# Altium schematic sheet FD-JUL-BB_SCH.SchDoc
size B; DocumentNumber: 1; SheetNumber: 1; SheetTotal: 1; ENG_APP_DATE: --/--/--; DSN_APP_DATE: --/--/--; CHK_APP_DATE: --/--/--
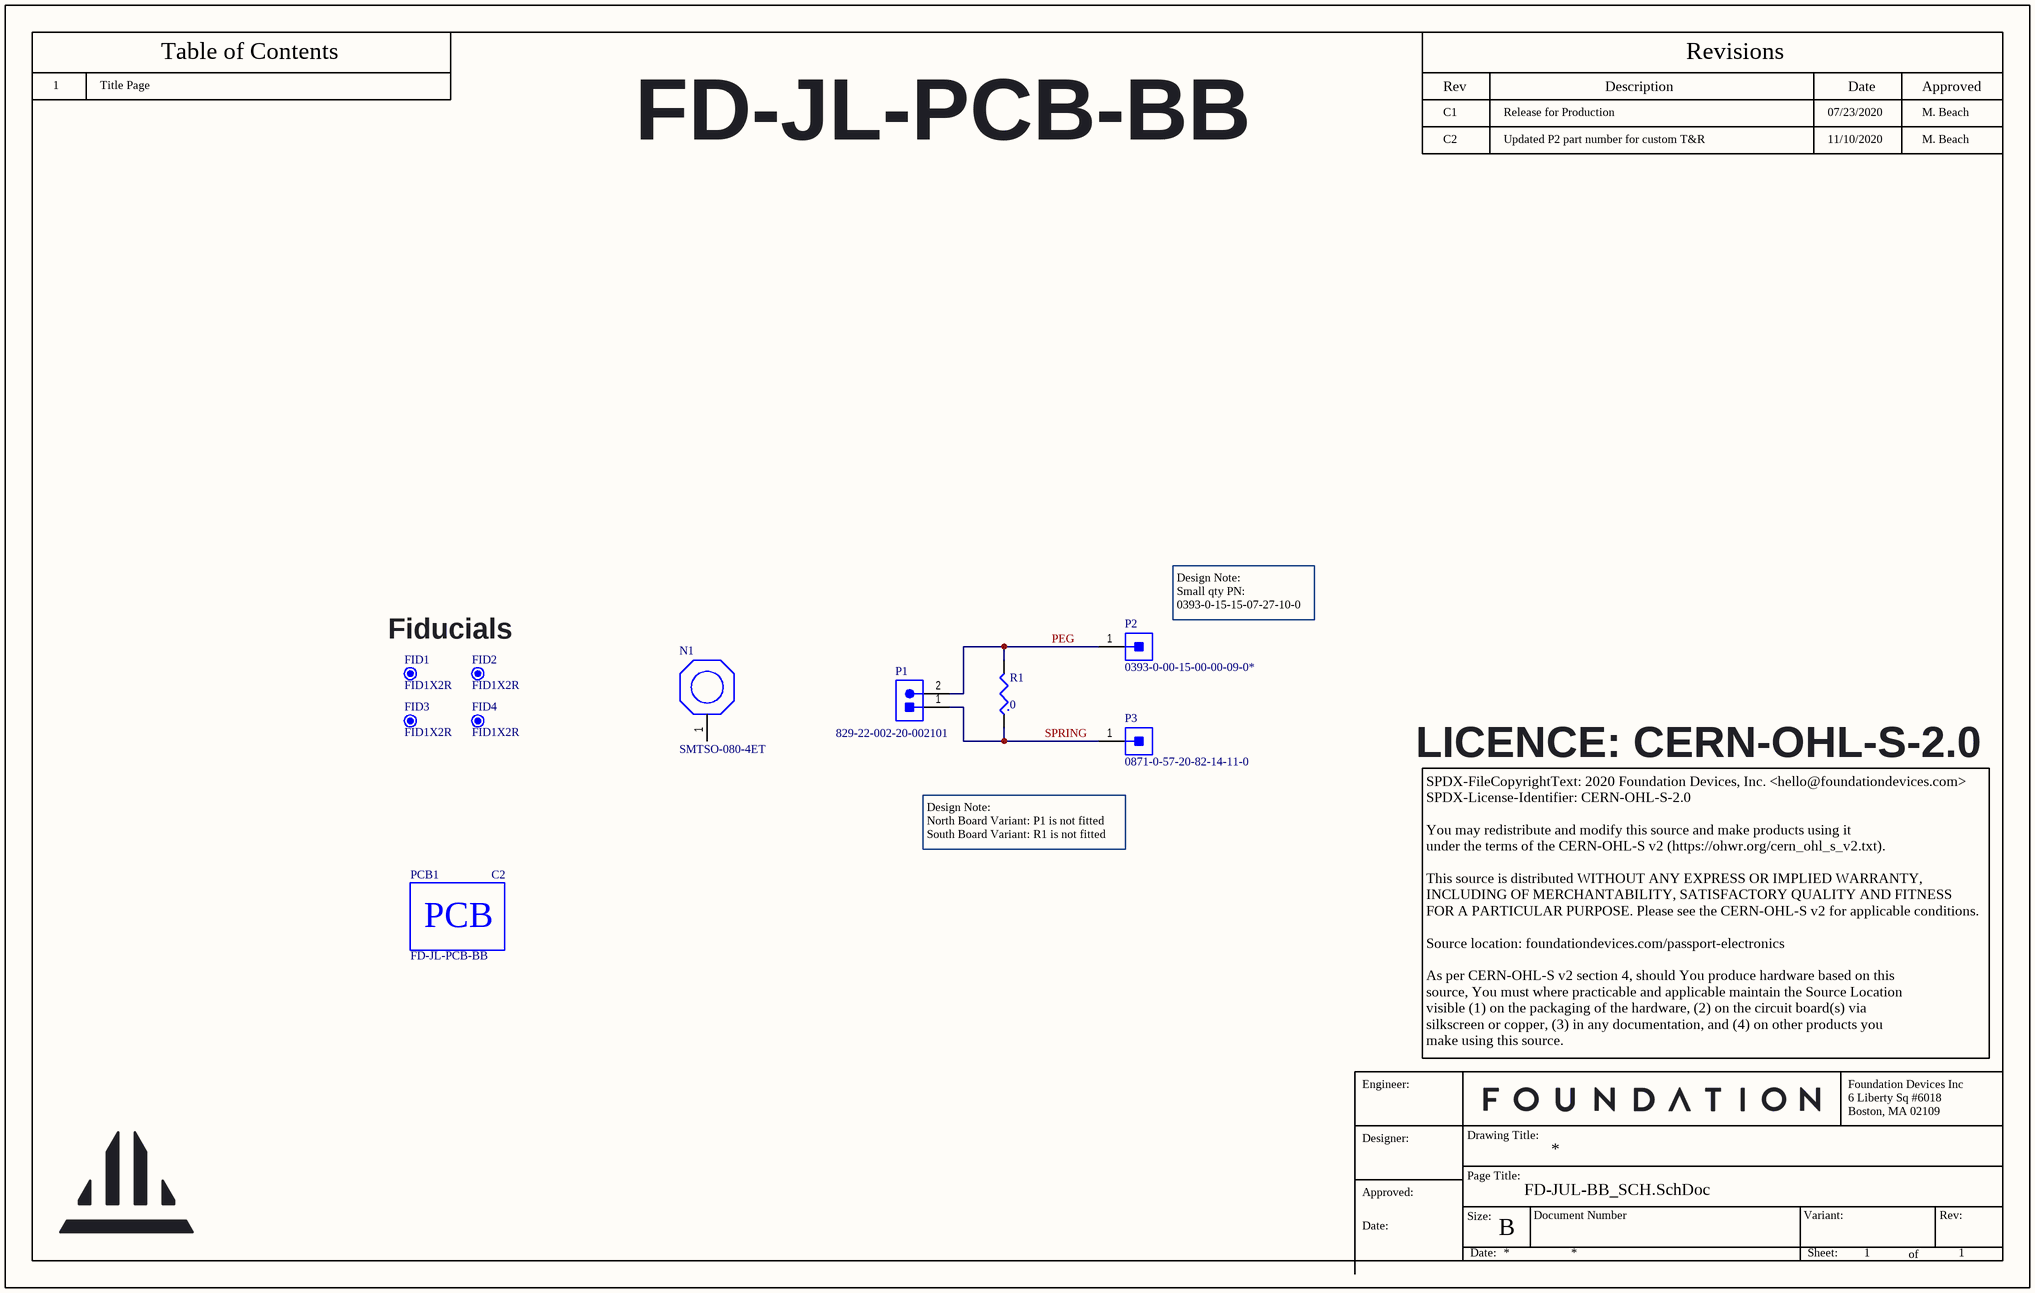
[diagram p0: FD-JUL-BB_SCH.SchDoc]

## Parts
FID1  FID1X2R  [FID1X2R]  (no BOM)
FID2  FID1X2R  [FID1X2R]  (no BOM)
FID3  FID1X2R  [FID1X2R]  (no BOM)
FID4  FID1X2R  [FID1X2R]  (no BOM)
N1  SMTSO-080-4ET  [PNENG - SMTSO-080-4ET]
P1  829-22-002-20-002101  [MIMX - 829-22-002-20-002101_V]
P2  0393-0-00-15-00-00-09-0*  [MIMX - 0393]
P3  0871-0-57-20-82-14-11-0  [MIMX - 0871-0-15-20-82-14-11-0_V]
PCB1  FD-JL-PCB-BB  Rev: C2  (mechanical)
R1  Resistance: 0  [RESC0805(2012)_L]  (hidden comment: RES 0 OHM JUMPER 1/8W 0805)

## Nets
PEG: P1.2 P2.1 R1.2
SPRING: P1.1 P3.1 R1.1

Not connected (* = marked no-connect by the designer): N1 1(Nut)

## Notes on the sheet
- Title Page
- FD-JL-PCB-BB
- C1
- C2
- Release for Production
- Updated P2 part number for custom T&R
- 07/23/2020
- 11/10/2020
- M. Beach
- Fiducials
- Design Note:
  Small qty PN: 0393-0-15-15-07-27-10-0
- LICENCE: CERN-OHL-S-2.0
- Design Note:
  North Board Variant: P1 is not fitted
  South Board Variant: R1 is not fitted
- SPDX-FileCopyrightText: 2020 Foundation Devices, Inc. <hello@foundationdevices.com>
  SPDX-License-Identifier: CERN-OHL-S-2.0
  You may redistribute and modify this source and make products using it
  under the terms of the CERN-OHL-S v2 (https://ohwr.org/cern_ohl_s_v2.txt).
  This source is distributed WITHOUT ANY EXPRESS OR IMPLIED WARRANTY,
  INCLUDING OF MERCHANTABILITY, SATISFACTORY QUALITY AND FITNESS
  FOR A PARTICULAR PURPOSE. Please see the CERN-OHL-S v2 for applicable conditions.
  Source location: foundationdevices.com/passport-electronics
  As per CERN-OHL-S v2 section 4, should You produce hardware based on this
  source, You must where practicable and applicable maintain the Source Location
  visible (1) on the packaging of the hardware, (2) on the circuit board(s) via
  silkscreen or copper, (3) in any documentation, and (4) on other products you
  make using this source.
- 1
- Table of Contents
- Rev
- Description
- Revisions
- Date
- Approved
- Engineer:
- Foundation Devices Inc
- 6 Liberty Sq #6018
- Designer:
- Drawing Title:
- Page Title:
- Boston, MA 02109
- Approved:
- Date:
- Size:
- B
- Document Number
- Variant:
- Rev:
- Sheet:
- of

## Library data of the parts
FID1-FID4 = CMP-MECH-00000-3: Fiducial - Round 1x2mm; Pins: 0
N1 = CMP-MECH-00005-3: Surface Mount Nut; ComponentLink1Description: Website; ComponentLink1URL: https://catalog.pemnet.com/item/reelfast-micropem-surface-mount-nuts-standoffs/surface-mount-nuts-standoffs-br-type-smtso-unified/smtso-080-4et
P1 = CMP-CON-0049-1: 2 Position Spring Piston Connector Through Hole, Right Angle; Case/Package: SIP
P2 = CMP-CON-0052-1: Pin Receptacle Connector 0.065" ~ 0.082" (1.65mm ~ 2.08mm) No Tail Solder; Min Operating Temperature: -55°C; Case/Package: SMD/SMT; Max Operating Temperature: 125°C; Terminal Gender: Female; Terminal and Terminal Block Type: PCB TERMINAL
P3 = CMP-CON-0048-2: Contact Spring Surface Mount; Case/Package: SMD/SMT
PCB1 = CMP-MISC-00001-5: PCB - Juliet - Battery Board
R1 = CMP-RES-00052-1: 0 Ohms Jumper 0.125W, 1/8W Chip Resistor 0805 (2012 Metric); Max Power Dissipation: 125mW; Tolerance: 1%; Voltage Rating: 150V; Temperature Coefficient: 100ppm/°C; Case Code (Imperial): 0805; Depth: 1.25mm; Case Code (Metric): 2012; Min Operating Temperature: -55°C; Height: 0.45mm; Case/Package: 0805; Length: 2mm; Military Standard: Not; Termination: SMD/SMT; Contact Plating: Tin,Lead; Radiation Hardening: No; Composition: Thick Film; Width: 1.25mm; Voltage Rating (DC): 150V; REACH SVHC: Unknown; Package Quantity: 1; Number of Terminations: 2; Features: Automotive AEC-Q200; Weight: 0.000194oz; Power Rating: 125mW; Max Operating Temperature: 155°C; Packaging: Tape and Reel; Lead Free: Lead Free